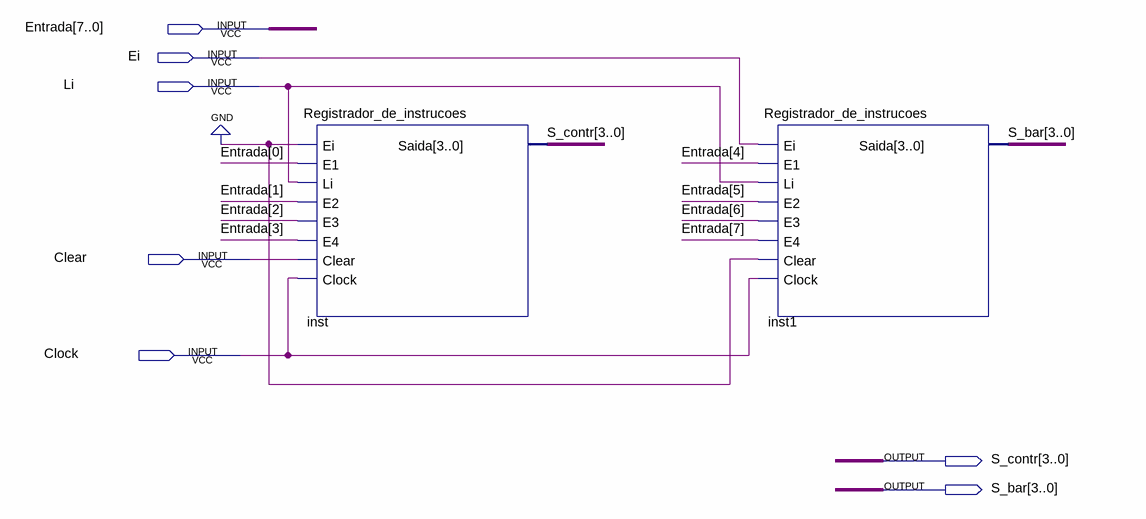
[diagram p0: schematic sheet]
// Quartus schematic Registrador_de_instrucoes_completo.bdf as structural Verilog: 2 symbols, 7 pins
module Registrador_de_instrucoes_completo (
  input  [7:0] Entrada,
  input  Ei,
  input  Li,
  input  Clear,
  input  Clock,
  output [3:0] S_contr,
  output [3:0] S_bar
);

  Registrador_de_instrucoes inst (
    .Ei(1'b0), .E1(Entrada[0]), .Li(Li), .E2(Entrada[1]), .E3(Entrada[2]), .E4(Entrada[3]), .Clear(Clear),
    .Clock(Clock), .Saida(S_contr));
  Registrador_de_instrucoes inst1 (
    .Ei(Ei), .E1(Entrada[4]), .Li(Li), .E2(Entrada[5]), .E3(Entrada[6]), .E4(Entrada[7]), .Clear(1'b0),
    .Clock(Clock), .Saida(S_bar));
endmodule
